# Altium project ModemExt.PrjPcb
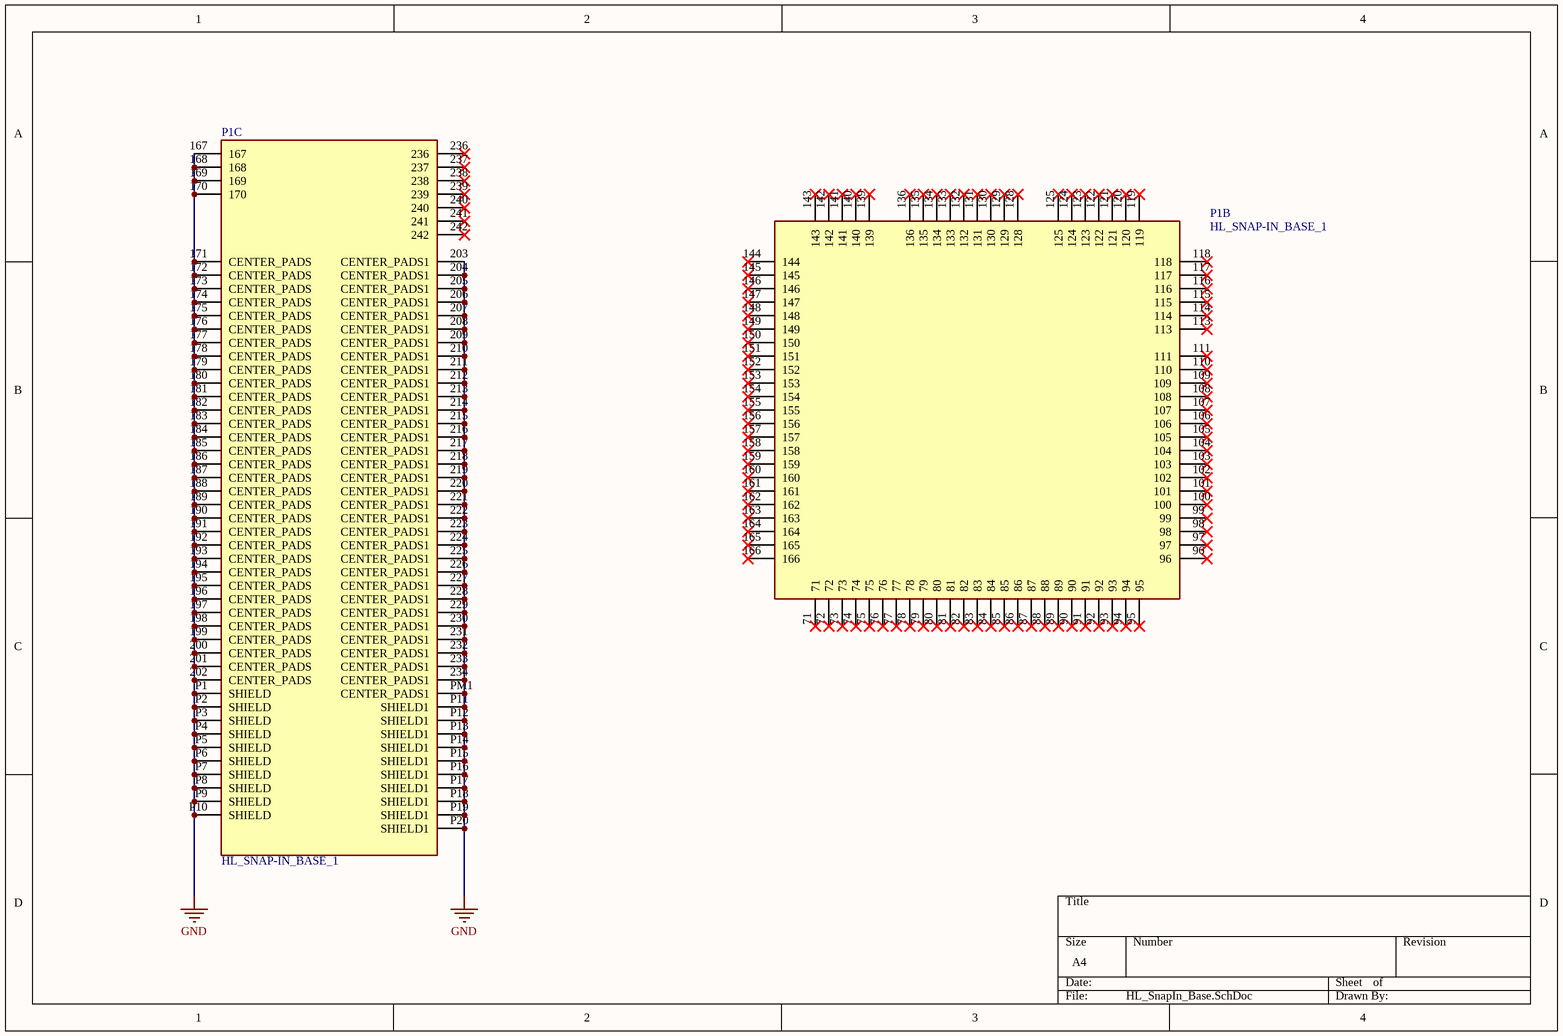
[diagram p0: HL_SnapIn_Base.SchDoc]
2 sheets, 26 parts. Net scope: global (net labels, ports and power ports of the same name join across sheets).
Board file: ModemExt.PcbDoc
Sheets:
  HL_SnapIn_Base.SchDoc
  ModemExt2.SchDoc

## Sheet HL_SnapIn_Base.SchDoc
size A4

### Parts
P1  HL_SNAP-IN_BASE_1  [SIERRA_WP_SNAP-IN_BASE]  (parts B,C of 3)

### Nets
GND: P1.167 P1.168 P1.169 P1.170 P1.171(CENTER_PADS) P1.172(CENTER_PADS) P1.173(CENTER_PADS) P1.174(CENTER_PADS) P1.175(CENTER_PADS) P1.176(CENTER_PADS) P1.177(CENTER_PADS) P1.178(CENTER_PADS) P1.179(CENTER_PADS) P1.180(CENTER_PADS) P1.181(CENTER_PADS) P1.182(CENTER_PADS) P1.183(CENTER_PADS) P1.184(CENTER_PADS) P1.185(CENTER_PADS) P1.186(CENTER_PADS) P1.187(CENTER_PADS) P1.188(CENTER_PADS) P1.189(CENTER_PADS) P1.190(CENTER_PADS) P1.191(CENTER_PADS) P1.192(CENTER_PADS) P1.193(CENTER_PADS) P1.194(CENTER_PADS) P1.195(CENTER_PADS) P1.196(CENTER_PADS) P1.197(CENTER_PADS) P1.198(CENTER_PADS) P1.199(CENTER_PADS) P1.200(CENTER_PADS) P1.201(CENTER_PADS) P1.202(CENTER_PADS) P1.203(CENTER_PADS1) P1.204(CENTER_PADS1) P1.205(CENTER_PADS1) P1.206(CENTER_PADS1) P1.207(CENTER_PADS1) P1.208(CENTER_PADS1) P1.209(CENTER_PADS1) P1.210(CENTER_PADS1) P1.211(CENTER_PADS1) P1.212(CENTER_PADS1) P1.213(CENTER_PADS1) P1.214(CENTER_PADS1) P1.215(CENTER_PADS1) P1.216(CENTER_PADS1) P1.217(CENTER_PADS1) P1.218(CENTER_PADS1) P1.219(CENTER_PADS1) P1.220(CENTER_PADS1) P1.221(CENTER_PADS1) P1.222(CENTER_PADS1) P1.223(CENTER_PADS1) P1.224(CENTER_PADS1) P1.225(CENTER_PADS1) P1.226(CENTER_PADS1) P1.227(CENTER_PADS1) P1.228(CENTER_PADS1) P1.229(CENTER_PADS1) P1.230(CENTER_PADS1) P1.231(CENTER_PADS1) P1.232(CENTER_PADS1) P1.233(CENTER_PADS1) P1.234(CENTER_PADS1) P1.P1(SHIELD) P1.P2(SHIELD) P1.P3(SHIELD) P1.P4(SHIELD) P1.P5(SHIELD) P1.P6(SHIELD) P1.P7(SHIELD) P1.P8(SHIELD) P1.P9(SHIELD) P1.P10(SHIELD) P1.P11(SHIELD1) P1.P12(SHIELD1) P1.P13(SHIELD1) P1.P14(SHIELD1) P1.P15(SHIELD1) P1.P16(SHIELD1) P1.P17(SHIELD1) P1.P18(SHIELD1) P1.P19(SHIELD1) P1.P20(SHIELD1) P1.PM1(CENTER_PADS1)

Not connected (* = marked no-connect by the designer): P1 71* 72* 73* 74* 75* 76* 77* 78* 79* 80* 81* 82* 83* 84* 85* 86* 87* 88* 89* 90* 91* 92* 93* 94* 95* 96* 97* 98* 99* 100* 101* 102* 103* 104* 105* 106* 107* 108* 109* 110* 111* 113* 114* 115* 116* 117* 118* 119* 120* 121* 122* 123* 124* 125* 128* 129* 130* 131* 132* 133* 134* 135* 136* 139* 140* 141* 142* 143* 144* 145* 146* 147* 148* 149* 150* 151* 152* 153* 154* 155* 156* 157* 158* 159* 160* 161* 162* 163* 164* 165* 166* 236* 237* 238* 239* 240* 241* 242*

### Library data of the parts
P1 = HL_SNAP-IN_BASE_1: WP SNAP IN SOCKET BASE FRAME 157 / HL7650; MF: Sierra Wireless; MP: WP SNAP-IN BASE; Availability: Unavailable; SnapEDA_Link: https://www.snapeda.com/parts/WP%20SNAP-IN%20BASE/Sierra%20Wireless/view-part/1245533/?ref=snap; Price: None; Package: None; Value: *

## Sheet ModemExt2.SchDoc
size A4
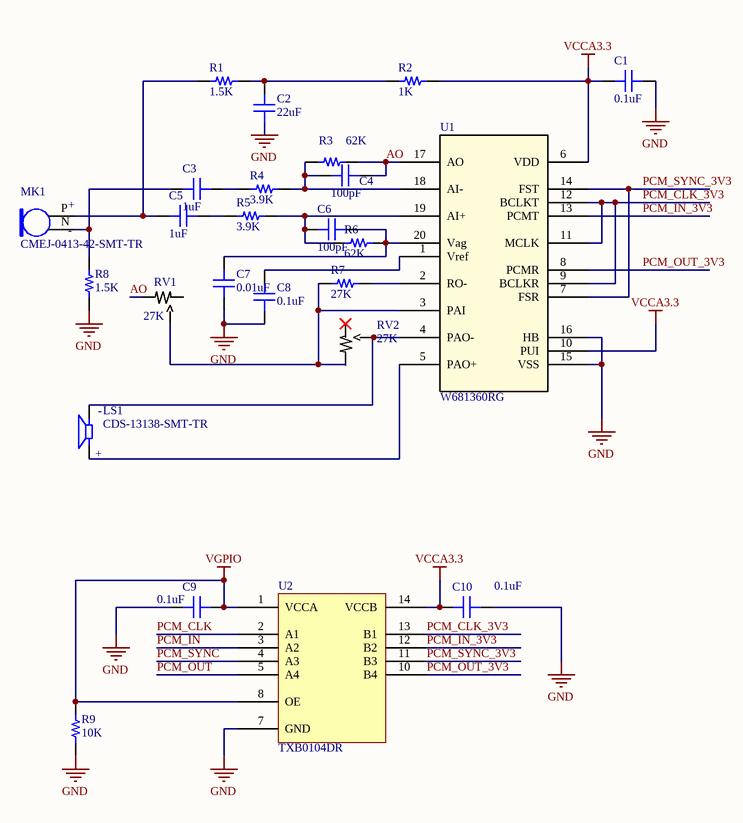
[diagram p1: ModemExt2.SchDoc]

### Parts
C1  0.1uF  [CAP 0402_1005]
C2  22uF  [CAP 0402_1005]
C3  1uF  [CAP 0402_1005]
C4  100pF  [CAP 0402_1005]
C5  1uF  [CAP 0402_1005]
C6  100pF  [CAP 0402_1005]
C7  0.01uF  [CAP 0402_1005]
C8  0.1uF  [CAP 0402_1005]
C9  0.1uF  [CAP 0402_1005]
C10  0.1uF  [CAP 0402_1005]
LS1  CDS-13138-SMT-TR  [SPKR_CDS-13138-SMT-TR]
MK1  CMEJ-0413-42-SMT-TR  [MIC_CMEJ-0413-42-SMT-TR]
R1  1.5K  [RES 0603_1608]
R2  1K  [RES 0603_1608]
R3  62K  [RES 0603_1608]
R4  3.9K  [RES 0603_1608]
R5  3.9K  [RES 0603_1608]
R6  62K  [RES 0603_1608]
R7  27K  [RES 0603_1608]
R8  1.5K  [RES 0603_1608]
R9  10K  [RES 0603_1608]
RV1  value 27K  [*TRIM_3313J-1-503E]  (hidden comment: 3313J-1-503E)
RV2  value 27K  [*TRIM_3313J-1-503E]  (hidden comment: 3313J-1-503E)
U1  W681360RG  [SSOP20_MC_MCH]
U2  TXB0104DR  [TI SOIC-14 D]

### Nets
GND: C1.1 C2.2 C7.2 C8.2 C9.1 C10.2 R8.2 R9.2 U1.15(VSS) U1.16(HB) U2.7(GND)
VCCA3.3: C1.2 C10.1 R2.1 U1.6(VDD) U1.10(PUI) U2.14(VCCB)
VGPIO: C9.2 R9.1 U2.1(VCCA) U2.8(OE)
AO: C4.1 R3.1 RV1.1(CCW) U1.17(AO)
PCM_CLK: U2.2(A1)
PCM_CLK_3V3: U1.9(BCLKR) U1.11(MCLK) U1.12(BCLKT) U2.13(B1)
PCM_IN: U2.3(A2)
PCM_IN_3V3: U1.13(PCMT) U2.12(B2)
PCM_OUT: U2.5(A4)
PCM_OUT_3V3: U1.8(PCMR) U2.10(B4)
PCM_SYNC: U2.4(A3)
PCM_SYNC_3V3: U1.7(FSR) U1.14(FST) U2.11(B3)
NetC2_1: C2.1 R1.1 R2.2
NetC3_1: C3.1 R4.2
NetC3_2: C3.2 MK1.N(GND) R8.1
NetC4_2: C4.2 R3.2 R4.1 U1.18(AI-)
NetC5_1: C5.1 R5.2
NetC5_2: C5.2 MK1.P(OUTPUT) R1.2
NetC6_1: C6.1 C7.1 R6.1 U1.20(Vag)
NetC6_2: C6.2 R5.1 R6.2 U1.19(AI+)
NetC8_1: C8.1 U1.1(Vref)
NetLS1_M: LS1.M RV2.2(WIPER) U1.4(PAO-)
NetLS1_P: LS1.P U1.5(PAO+)
NetR7_1: R7.1 U1.2(RO-)
NetR7_2: R7.2 RV1.2(WIPER) RV2.1(CCW) U1.3(PAI)

Not connected (* = marked no-connect by the designer): RV1 3(CW); RV2 3(CW)*

### Notes on the sheet
- (in symbol CDS-13138-SMT-TR) -; +
- (in symbol CMEJ-0413-42-SMT-TR) +; -

### Library data of the parts
C1-C10 = GRM155R61A225ME95D: CAP CER 2.2UF 10V X5R 0402 / grm155r61a; Manufacturer: Murata Electronics; Capacitance: 2.2µF; Tolerance: ±20%; Part Number: GRM155R61A225ME95D; Applications: General Purpose; ComponentLink1Description: Datasheet; ComponentLink1URL: https://search.murata.co.jp/Ceramy/image/img/A01X/G101/ENG/GRM155R61A225ME95-01.pdf; ComponentLink2Description: DigiKey Link; ComponentLink2URL: http://digikey.com/product-detail/en/murata-electronics/GRM155R61A225ME95D/490-10452-1-ND/5026362; Device Package: 0402 (1005 Metric); LastUpdated: 4/1/2020 11:56:49 PM; Lifecycle Status: Active; Minimum Order: 1; Mounting Type: Surface Mount, MLCC; Operating Temperature: -55°C ~ 85°C; Package / Case: 0402 (1005 Metric); Packaging: TapeAndReel; PartId: 7450; Part Status: Active; Price: 0.02; Series: GRM; Size / Dimension: 0.039" L x 0.020" W (1.00mm x 0.50mm); Supplier 1: DigiKey; Supplier Part Number 1: 490-10452-1-ND; Temperature Coefficient: X5R; Thickness (Max): 0.022" (0.55mm); Voltage - Rated: 10V
  C1 C8-C10: Value: 0.1uF
  C2: Value: 22uF
  C3 C5: Value: 1uF
  C4 C6: Value: 100pF
  C7: Value: 0.01uF
LS1 = CDS-13138-SMT-TR: 13 mm, Square Frame, 0.7 W, 8 Ohm, Samarium Cobalt Magnet, Mylar Cone; MF: CUI Devices; CUI_purchase_URL: https://www.cuidevices.com/product/audio/speakers/miniature-_10-mm~40-mm_/cds-13138-smt?utm_source=snapeda.com&utm_medium=referral&utm_campaign=snapedaBOM; MP: CDS-13138-SMT-TR; SnapEDA_Link: https://www.snapeda.com/parts/CDS-13138-SMT-TR/CUI%20Devices/view-part/2770915/?ref=snap; Price: None; Package: CUI Inc.; Value: *; Availability: Unavailable
MK1 = CMEJ-0413-42-SMT-TR: 4.0 mm, Omnidirectional, Surface Mount, 2 Vdc, Electret Condenser Microphone; MF: CUI Devices; Availability: Unavailable; Price: None; Value: *; SnapEDA_Link: https://www.snapeda.com/parts/CMEJ-0413-42-SMT-TR/CUI%20Devices/view-part/3660757/?ref=snap; MP: CMEJ-0413-42-SMT-TR
R1-R9 = AC0603FR-0710KL: RES SMD 10K OHM 1% 1/10W 0603; Manufacturer: Yageo; Power (Watts): 0.1W, 1/10W; Resistance: 10 kOhms; Temperature Coefficient: ±100ppm/°C; Part Number: AC0603FR-0710KL; ComponentLink1Description: Datasheet; ComponentLink1URL: https://www.yageo.com/upload/media/product/productsearch/datasheet/rchip/PYu-AC_51_RoHS_L_7.pdf; ComponentLink2Description: DigiKey Link; ComponentLink2URL: http://digikey.com/product-detail/en/yageo/AC0603FR-0710KL/311-10KLDCT-ND/2828135; Composition: Thick Film; Device Package: 0603 (1608 Metric); Features: Automotive AEC-Q200, Moisture Resistant; Height - Seated (Max): 0.022" (0.55mm); LastUpdated: 1/21/2020 12:19:55 AM; Lifecycle Status: Active; Minimum Order: 1; Number of Terminations: 2; Operating Temperature: -55°C ~ 155°C; Package / Case: 0603 (1608 Metric); Packaging: CutTape; PartId: 17347; Part Status: Active; Price: 0.10; Ratings: AEC-Q200; Series: AC; Size / Dimension: 0.063" L x 0.031" W (1.60mm x 0.80mm); Supplier 1: DigiKey; Supplier Part Number 1: 311-10KLDCT-ND; Supplier Device Package: 0603; Tolerance: ±1%
  R1 R8: Value: 1.5K
  R2: Value: 1K
  R3 R6: Value: 62K
  R4 R5: Value: 3.9K
  R7: Value: 27K
  R9: Value: 10K
U1 = Audio Codec: No Description Available; Manufacturer_Part_Number: PIC16F685-E/SS; Vendor: Microchip; Built_By: EMA_Jessica; SourceLibrary: Microchip_2019-08-23_9; Copyright: Copyright (C) 2018 Accelerated Designs. All rights reserved; RefDes: RefDes; Type: DEV
U2 = TXB0104DR: IC TRNSLTR BIDIRECTIONAL 14SOIC; Manufacturer: Texas Instruments; Channels per Circuit: 4; Data Rate: 100Mbps; Number of Circuits: 1; Output Type: Tri-State, Non-Inverted; Translator Type: Voltage Level; Voltage - VCCA: 1.2V ~ 3.6V; Voltage - VCCB: 1.65V ~ 5.5V; Part Number: TXB0104DR; Channel Type: Bidirectional; ComponentLink1Description: Datasheet; ComponentLink1URL: http://www.ti.com/general/docs/suppproductinfo.tsp?distId=10&gotoUrl=http%3A%2F%2Fwww.ti.com%2Flit%2Fgpn%2Ftxb0104; ComponentLink2Description: DigiKey Link; ComponentLink2URL: http://digikey.com/product-detail/en/texas-instruments/TXB0104DR/296-21928-1-ND/1629281; Device Package: 14-SOIC (0.154", 3.90mm Width); Features: Auto-Direction Sensing; LastUpdated: 5/13/2020 5:06:13 PM; Lifecycle Status: Active; Minimum Order: 1; Mounting Type: Surface Mount; Operating Temperature: -40°C ~ 85°C (TA); Package / Case: 14-SOIC (0.154", 3.90mm Width); Packaging: TapeAndReel; Part Status: Active; Price: 0.54; Series: -; Supplier 1: DigiKey; Supplier Part Number 1: 296-21928-1-ND; Supplier Device Package: 14-SOIC
RV1 RV2 = 3313J-1-503E: SnapEDA_Link: https://www.snapeda.com/parts/3313J-1-503E/Bourns/view-part/327155/?ref=snap

## Nets that join several sheets
GND: HL_SnapIn_Base (89 pins), ModemExt2 (11 pins)